# Altium schematic sheet STM32H7XX_100PIN.SchDoc
size A1
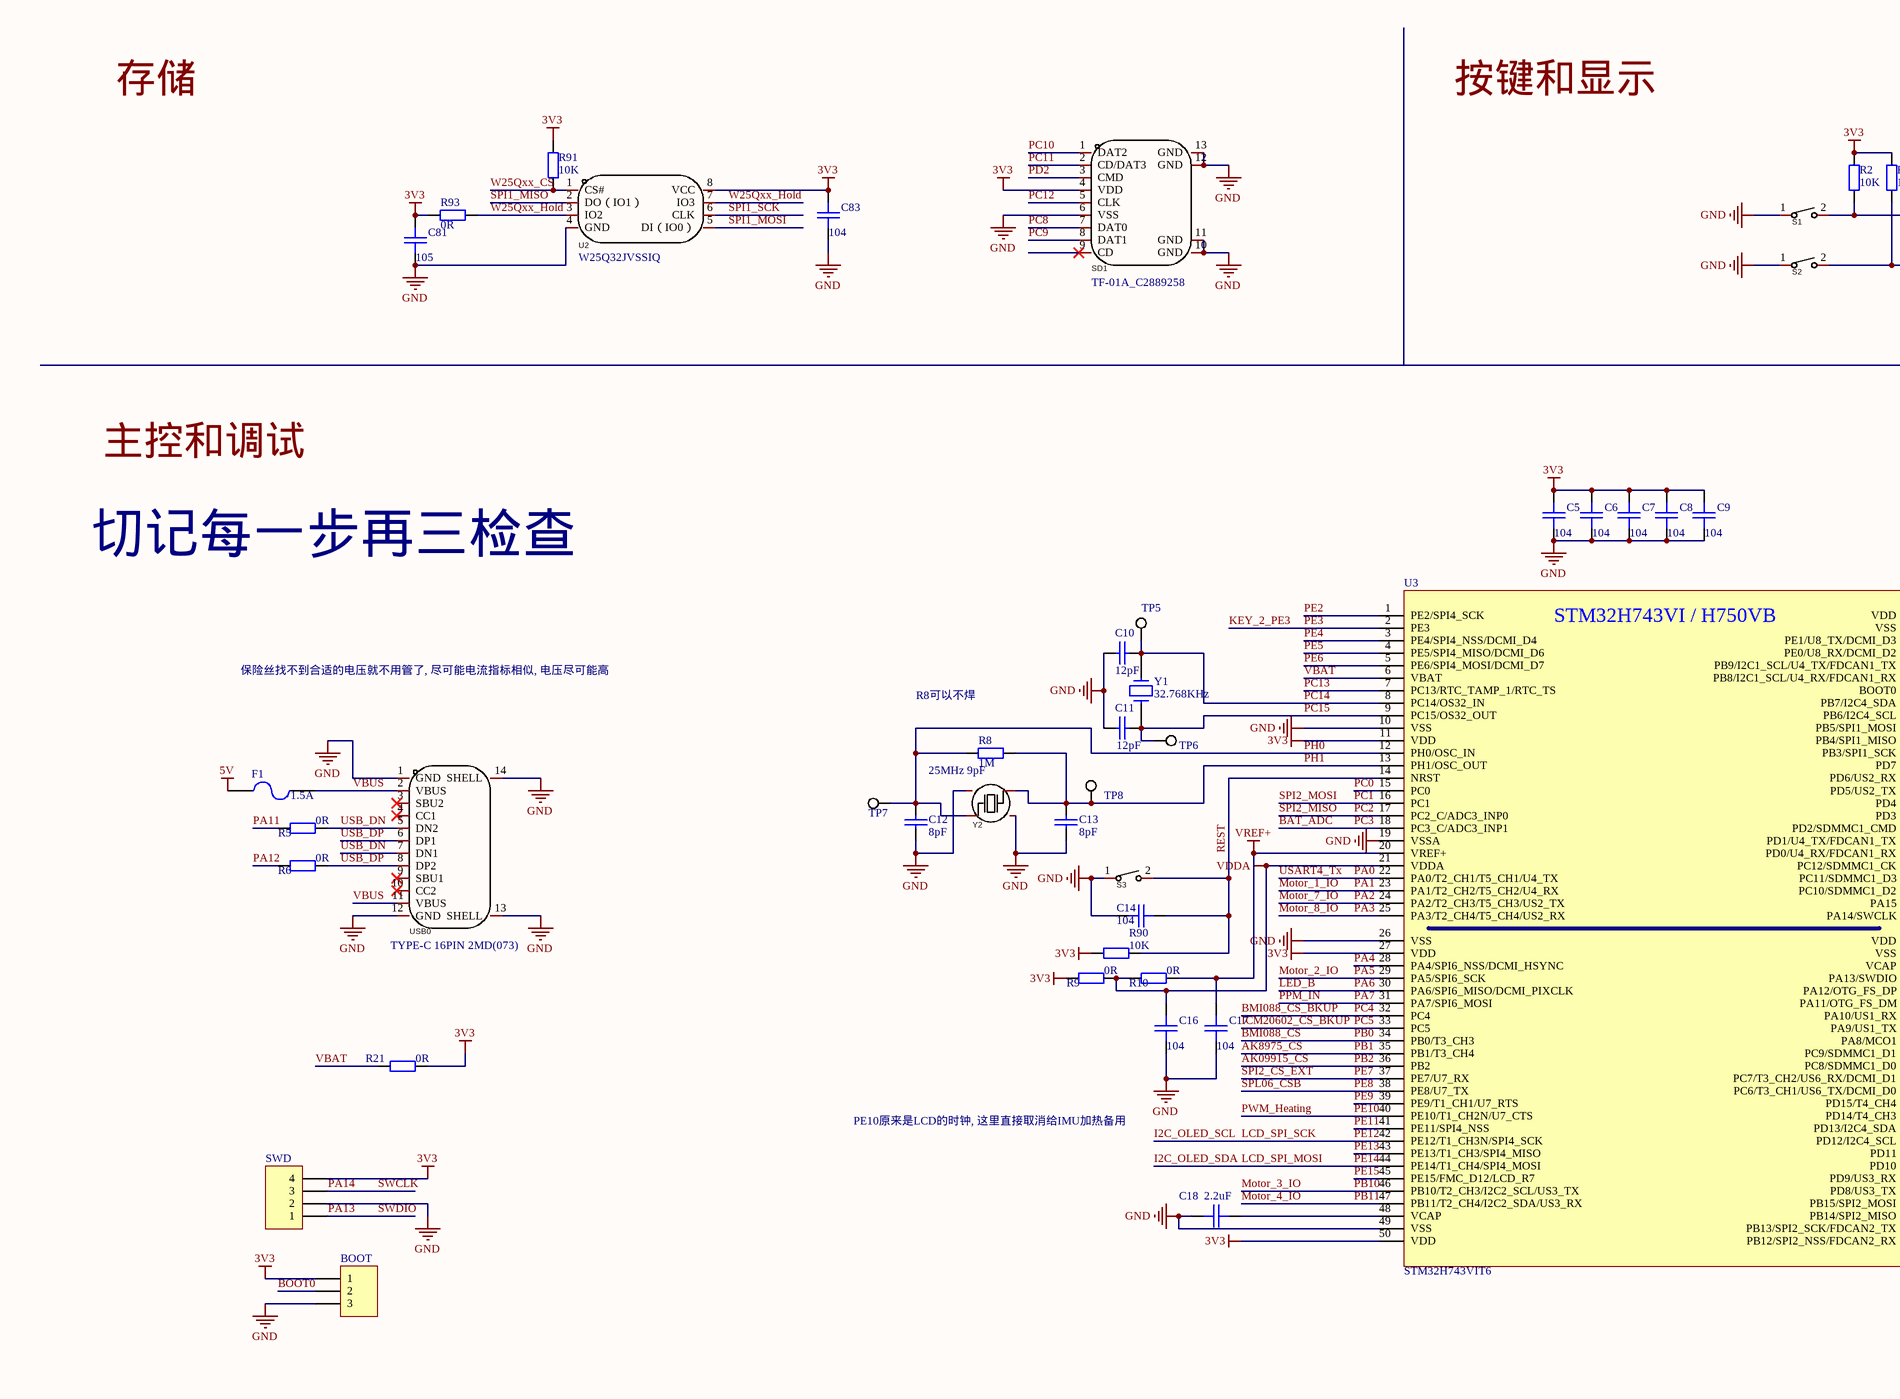
[diagram p0: STM32H7XX_100PIN.SchDoc, top left]
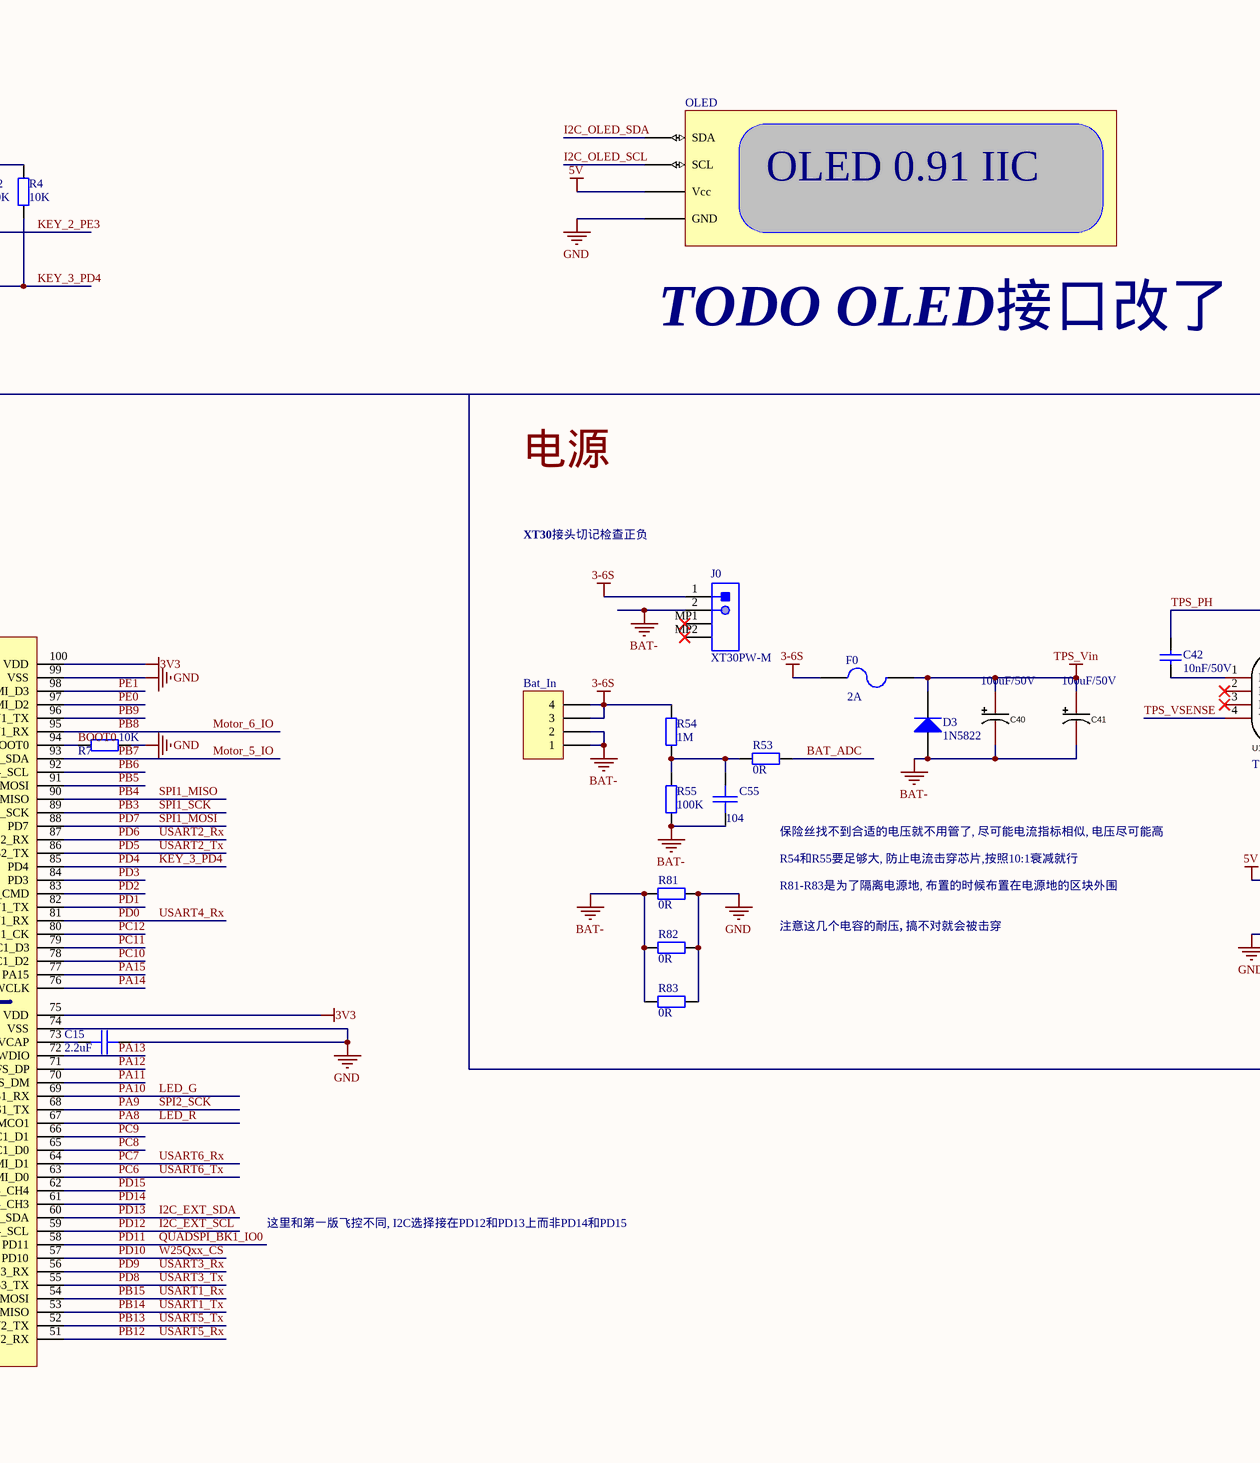
[diagram p1: STM32H7XX_100PIN.SchDoc, top middle]
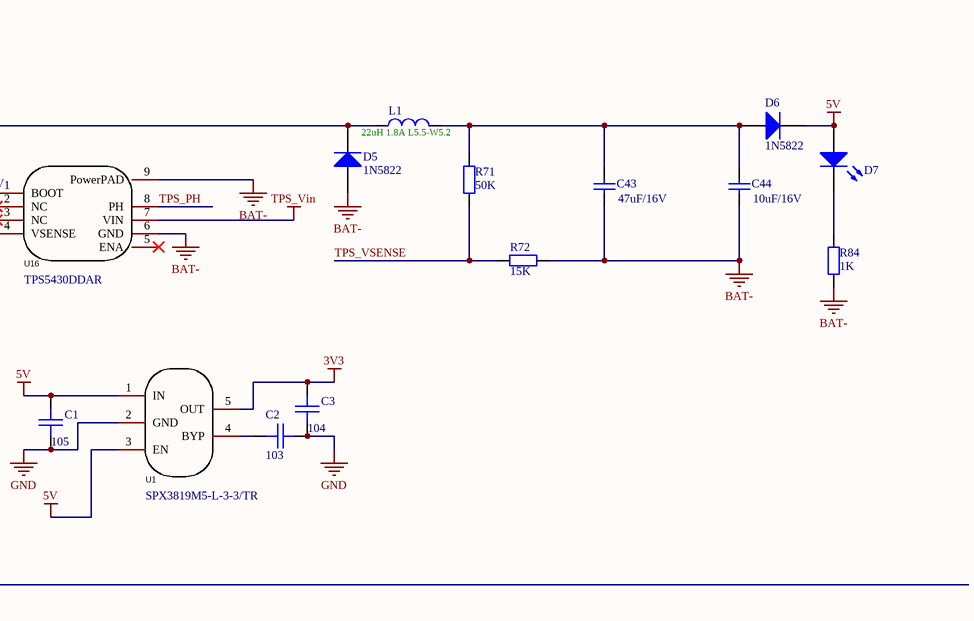
[diagram p2: STM32H7XX_100PIN.SchDoc, top right]
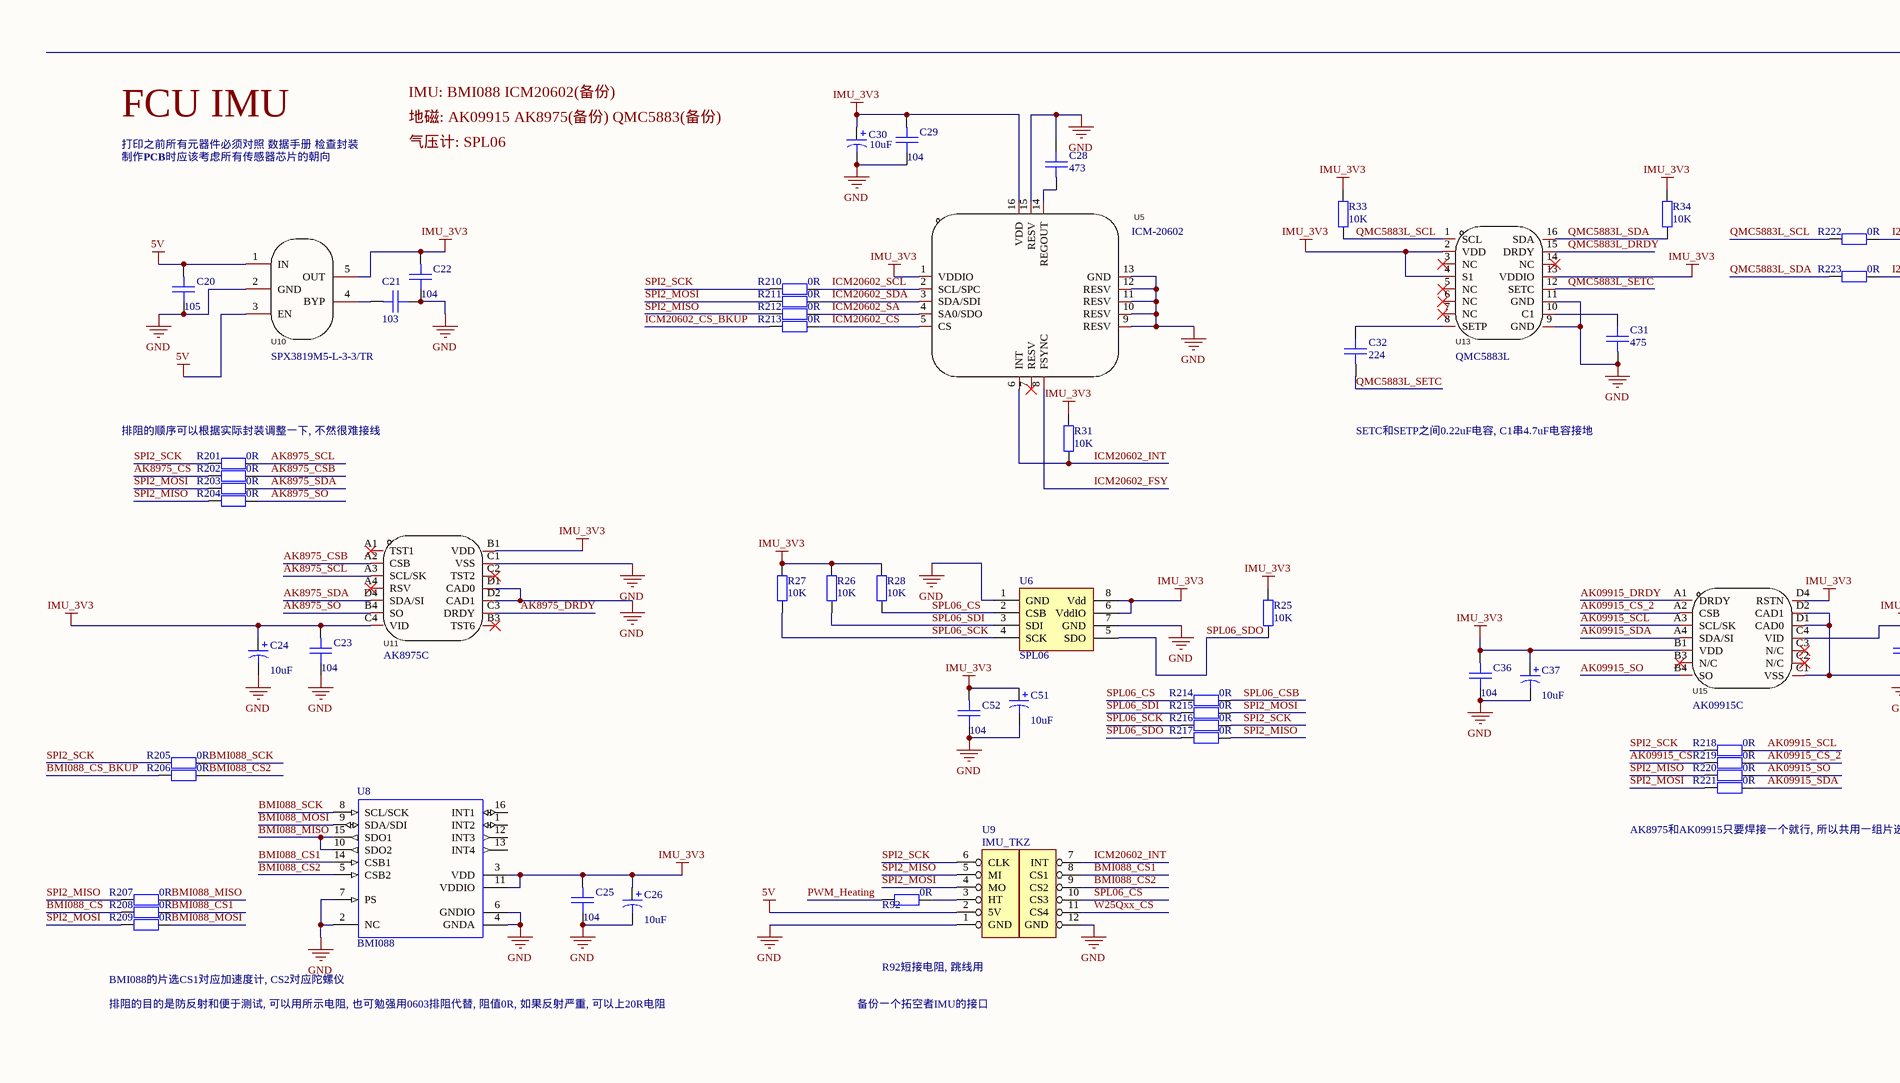
[diagram p3: STM32H7XX_100PIN.SchDoc, bottom left]
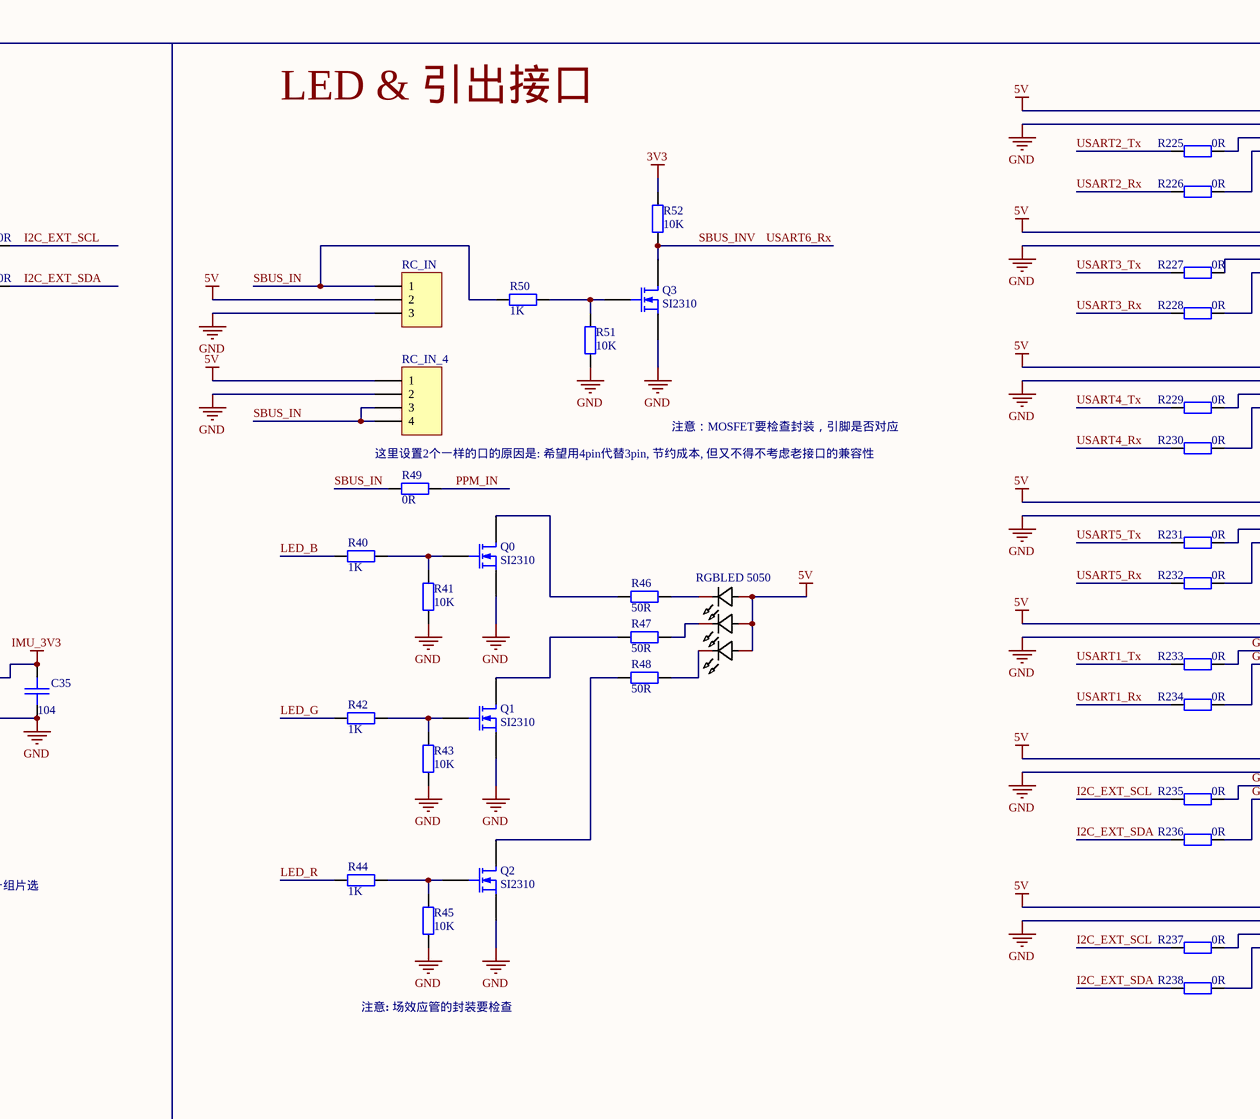
[diagram p4: STM32H7XX_100PIN.SchDoc, bottom middle]
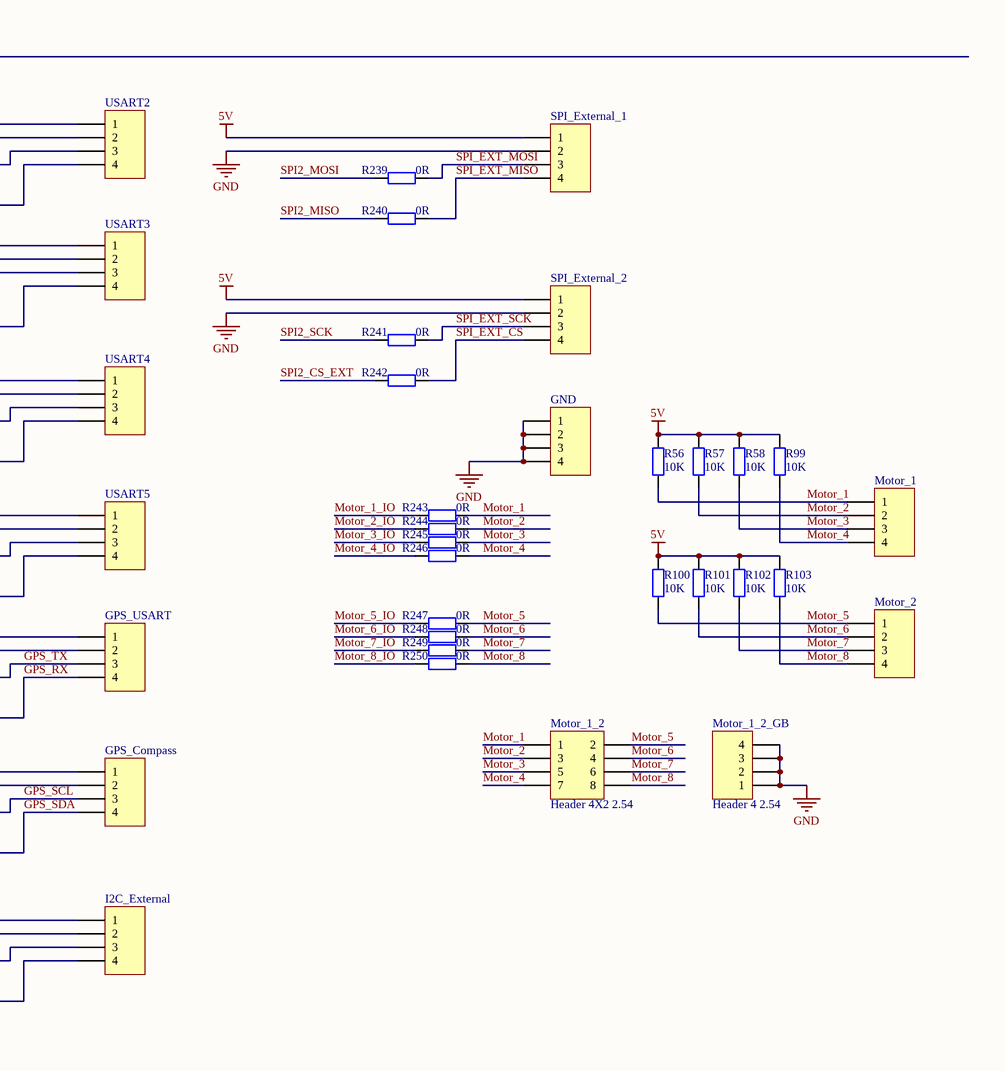
[diagram p5: STM32H7XX_100PIN.SchDoc, bottom right]

## Parts
Bat_In  SH1.0-4  [SH_1.0_卧]  (value not drawn)
BOOT  Header 3 2.54  [HDR1X3]  (value not drawn)
C1  105  [C0402]
C2  103  [C0402]
C3  104  [C0402]
C5  104  [C0402]
C6  104  [C0402]
C7  104  [C0402]
C8  104  [C0402]
C9  104  [C0402]
C10  12pF  [C0402]
C11  12pF  [C0402]
C12  8pF  [C0402]
C13  8pF  [C0402]
C14  104  [C0402]
C15  2.2uF  [C0402]
C16  104  [C0402]
C17  104  [C0402]
C18  2.2uF  [C0402]
C20  105  [C0402]
C21  103  [C0402]
C22  104  [C0402]
C23  104  [C0402]
C24  10uF  [TAN-A(3216-18)]
C25  104  [C0402]
C26  10uF  [TAN-A(3216-18)]
C28  473  [C0402]
C29  104  [C0402]
C30  10uF  [TAN-A(3216-18)]
C31  475  [C0402]
C32  224  [C0402]
C35  104  [C0402]
C36  104  [C0402]
C37  10uF  [TAN-A(3216-18)]
C40  100uF/50V  [CAP-SMD_BD6.3-L6.6-W6.6-FD]
C41  100uF/50V  [CAP-SMD_BD6.3-L6.6-W6.6-FD]
C42  10nF/50V  [C1206]
C43  47uF/16V  [C1210]
C44  10uF/16V  [C1210]
C51  10uF  [TAN-A(3216-18)]
C52  104  [C0402]
C55  104  [C0402]
C81  105  [C0402]
C83  104  [C0402]
D0  RGBLED 5050  [LED-SMD_6P-L5.0-W5.0-TL_TC5050RGBF08]
D3  1N5822  [SMA_L4.3-W2.5-LS5.0-RD]
D5  1N5822  [SMA_L4.3-W2.5-LS5.0-RD]
D6  1N5822  [SMA_L4.3-W2.5-LS5.0-RD]
D7  Red LED  [LED0603]  (value not drawn)
F0  2A  [FU 1210]
F1  1.5A  [FU 0402]
GND  SH1.0-4  [SH_1.0_卧]  (value not drawn)
GPS_Compass  SH1.0-4  [SH_1.0_卧]  (value not drawn)
GPS_USART  SH1.0-4  [SH_1.0_卧]  (value not drawn)
I2C_External  SH1.0-4  [SH_1.0_卧]  (value not drawn)
J0  XT30PW-M  [AMASS-XT30PW-M]
L1  22uH 1.8A L5.5-W5.2  [IND-SMD_L5.5-W5.2]
Motor_1  SH1.0-4  [SH_1.0_卧]  (value not drawn)
Motor_1_2  Header 4X2 2.54  [HDR2X4]
Motor_1_2_GB  Header 4 2.54  [HDR1X4]
Motor_2  SH1.0-4  [SH_1.0_卧]  (value not drawn)
OLED  OLED 0.91  [PCBComponent_1]  (value not drawn)
Q0  SI2310  [SOT-23R]
Q1  SI2310  [SOT-23R]
Q2  SI2310  [SOT-23R]
Q3  SI2310  [SOT-23R]
R2  10K  [R0402]
R4  10K  [R0402]
R5  0R  [R0402]
R6  0R  [R0402]
R7  10K  [R0402]
R8  1M  [R0402]
R9  0R  [R0402]
R10  0R  [R0402]
R21  0R  [R0402]
R25  10K  [R0402]
R26  10K  [R0402]
R27  10K  [R0402]
R28  10K  [R0402]
R31  10K  [R0402]
R33  10K  [R0402]
R34  10K  [R0402]
R40  1K  [R0402]
R41  10K  [R0402]
R42  1K  [R0402]
R43  10K  [R0402]
R44  1K  [R0402]
R45  10K  [R0402]
R46  50R  [R0402]
R47  50R  [R0402]
R48  50R  [R0402]
R49  0R  [R0402]
R50  1K  [R0402]
R51  10K  [R0402]
R52  10K  [R0402]
R53  0R  [R0402]
R54  1M  [R0402]
R55  100K  [R0402]
R56  10K  [R0402]
R57  10K  [R0402]
R58  10K  [R0402]
R71  50K  [0805]
R72  15K  [0805]
R81  0R  [R0402]
R82  0R  [R0402]
R83  0R  [R0402]
R84  1K  [R0402]
R90  10K  [R0402]
R91  10K  [R0402]
R92  0R  [R0402]
R93  value 0R  [R0402]  (hidden comment: 10K)
R99  10K  [R0402]
R100  10K  [R0402]
R101  10K  [R0402]
R102  10K  [R0402]
R103  10K  [R0402]
R201  0R  [R0402]
R202  0R  [R0402]
R203  0R  [R0402]
R204  0R  [R0402]
R205  0R  [R0402]
R206  0R  [R0402]
R207  0R  [R0402]
R208  0R  [R0402]
R209  0R  [R0402]
R210  0R  [R0402]
R211  0R  [R0402]
R212  0R  [R0402]
R213  0R  [R0402]
R214  0R  [R0402]
R215  0R  [R0402]
R216  0R  [R0402]
R217  0R  [R0402]
R218  0R  [R0402]
R219  0R  [R0402]
R220  0R  [R0402]
R221  0R  [R0402]
R222  0R  [R0402]
R223  0R  [R0402]
R225  0R  [R0402]
R226  0R  [R0402]
R227  0R  [R0402]
R228  0R  [R0402]
R229  0R  [R0402]
R230  0R  [R0402]
R231  0R  [R0402]
R232  0R  [R0402]
R233  0R  [R0402]
R234  0R  [R0402]
R235  0R  [R0402]
R236  0R  [R0402]
R237  0R  [R0402]
R238  0R  [R0402]
R239  0R  [R0402]
R240  0R  [R0402]
R241  0R  [R0402]
R242  0R  [R0402]
R243  0R  [R0402]
R244  0R  [R0402]
R245  0R  [R0402]
R246  0R  [R0402]
R247  0R  [R0402]
R248  0R  [R0402]
R249  0R  [R0402]
R250  0R  [R0402]
RC_IN  SH 1.0-3  [SH_1.0_3P卧]  (value not drawn)
RC_IN_4  SH1.0-4  [SH_1.0_卧]  (value not drawn)
S1  TS-1092S-B3D2-G  [SW-SMD_L6.1-W3.6-LS7.9]  (value not drawn)
S2  TS-1092S-B3D2-G  [SW-SMD_L6.1-W3.6-LS7.9]  (value not drawn)
S3  TS-1092S-B3D2-G  [SW-SMD_L6.1-W3.6-LS7.9]  (value not drawn)
SD1  TF-01A_C2889258  [TF-SMD_TF-02]
SPI_External_1  SH1.0-4  [SH_1.0_卧]  (value not drawn)
SPI_External_2  SH1.0-4  [SH_1.0_卧]  (value not drawn)
SWD  SH1.0-4  [SH_1.0_卧]  (value not drawn)
TP5  Test Point  [TP-SM-C-100]  (value not drawn)
TP6  Test Point  [TP-SM-C-100]  (value not drawn)
TP7  Test Point  [TP-SM-C-100]  (value not drawn)
TP8  Test Point  [TP-SM-C-100]  (value not drawn)
U1  SPX3819M5-L-3-3/TR  [SOT-23-5_L3.0-W1.7-P0.95-LS2.8-BL]
U2  W25Q32JVSSIQ  [SOIC-8_L5.3-W5.3-P1.27-LS8.0-BL]
U3  STM32H743VIT6  [LQFP100-14*14]
U5  ICM-20602  [LGA-16_L3.0-W3.0-P0.50-BL]
U6  SPL06  [LGA-2_5X2MM]
U8  BMI088  [BOSC-LGA-16-BMI088_V]
U9  IMU_TKZ  [IMU_TKZ_SM2]
U10  SPX3819M5-L-3-3/TR  [SOT-23-5_L3.0-W1.7-P0.95-LS2.8-BL]
U11  AK8975C  [BGA-14_L2.0-W2.0-P0.50-BR_AK8975]
U13  QMC5883L  [LGA-16_L3.0-W3.0-P0.50-BL_SQ]
U15  AK09915C  [BGA-14_L1.6-W1.6-BR-AK09915C]
U16  TPS5430DDAR  [ESOP-8_L4.9-W3.9-P1.27-LS6.0-TL-EP]
USART2  SH1.0-4  [SH_1.0_卧]  (value not drawn)
USART3  SH1.0-4  [SH_1.0_卧]  (value not drawn)
USART4  SH1.0-4  [SH_1.0_卧]  (value not drawn)
USART5  SH1.0-4  [SH_1.0_卧]  (value not drawn)
USB0  TYPE-C 16PIN 2MD(073)  [USB-C-SMD_TYPE-C-6PIN-2MD-073]
Y1  32.768KHz  [OSC 3215-2P]
Y2  25MHz 9pF  [OSC-SMD_4P-L3.2-W2.5-BL]

## Nets
3-6S: Bat_In.3 Bat_In.4 F0.1 J0.1 R54.1
3V3: BOOT.1 C3.1 C5.1 C6.1 C7.1 C8.1 C9.1 C81.1 C83.1 R2.2 R4.2 R9.1 R21.2 R52.1 R90.1 R91.2 R93.2 SD1.4(VDD) SWD.4 U1.5(OUT) U2.8(VCC) U3.11(VDD) U3.27(VDD) U3.50(VDD) U3.75(VDD) U3.100(VDD)
5V: C1.1 C20.1 D0.1(+) D0.2(+) D0.3(+) D6.2(K) D7.1(A) F1.1 GPS_Compass.1 GPS_USART.1 I2C_External.1 OLED.1(Vcc) R56.1 R57.1 R58.1 R99.1 R100.1 R101.1 R102.1 R103.1 RC_IN.2 RC_IN_4.1 SPI_External_1.1 SPI_External_2.1 U1.1(IN) U1.3(EN) U9.2(5V) U10.1(IN) U10.3(EN) USART2.1 USART3.1 USART4.1 USART5.1
BAT-: Bat_In.1 Bat_In.2 C40.2 C41.2 C43.1 C44.1 C55.2 D3.1(A) D5.1(A) J0.2 R55.2 R72.2 R81.2 R82.2 R83.2 R84.2 U16.6(GND) U16.9(PowerPAD)
GND: BOOT.3 C1.2 C2.2 C3.2 C5.2 C6.2 C7.2 C8.2 C9.2 C10.1 C11.1 C12.2 C13.1 C14.1 C15.1 C16.2 C17.2 C18.2 C20.2 C21.2 C22.2 C23.2 C24.2 C25.2 C26.2 C28.2 C29.2 C30.2 C31.1 C35.2 C36.2 C37.2 C51.2 C52.2 C81.2 C83.2 GND.1 GND.2 GND.3 GND.4 GPS_Compass.2 GPS_USART.2 I2C_External.2 Motor_1_2_GB.1 Motor_1_2_GB.2 Motor_1_2_GB.3 Motor_1_2_GB.4 OLED.0(GND) Q0.3(S) Q1.3(S) Q2.3(S) Q3.3(S) R7.2 R41.2 R43.2 R45.2 R51.2 R81.1 R82.1 R83.1 RC_IN.3 RC_IN_4.2 S1.1 S2.1 S3.1 SD1.6(VSS) SD1.10(GND) SD1.11(GND) SD1.12(GND) SD1.13(GND) SPI_External_1.2 SPI_External_2.2 SWD.2 U1.2(GND) U2.4(GND) U3.10(VSS) U3.19(VSSA) U3.26(VSS) U3.49(VSS) U3.74(VSS) U3.99(VSS) U5.9(RESV) U5.10(RESV) U5.11(RESV) U5.12(RESV) U5.13(GND) U5.15(RESV) U6.1(GND) U6.7(GND) U8.2(NC) U8.4(GNDA) U8.6(GNDIO) U8.7(PS) U9.1(GND) U9.12(GND) U10.2(GND) U11.C1(VSS) U11.D1(CAD0) U11.D2(CAD1) U13.9(GND) U13.11(GND) U15.C1(VSS) U15.D1(CAD0) U15.D2(CAD1) USART2.2 USART3.2 USART4.2 USART5.2 USB0.1(GND) USB0.12(GND) USB0.13(SHELL) USB0.14(SHELL) Y2.2 Y2.4
IMU_3V3: C22.1 C23.1 C24.1 C25.1 C26.1 C29.1 C30.1 C35.1 C36.1 C37.1 C51.1 C52.1 R25.2 R26.2 R27.2 R28.2 R31.2 R33.2 R34.2 U5.1(VDDIO) U5.16(VDD) U6.6(VddIO) U6.8(Vdd) U8.3(VDD) U8.11(VDDIO) U10.5(OUT) U11.B1(VDD) U11.C4(VID) U13.2(VDD) U13.4(S1) U13.13(VDDIO) U15.B1(VDD) U15.C4(VID) U15.D4(RSTN)
TPS_Vin: C40.1 C41.1 D3.2(K) F0.2 U16.7(VIN)
VDDA: C16.1 R9.2 R10.1 U3.21(VDDA)
VREF+: C17.1 R10.2 U3.20(VREF+)
AK8975_CS: R202.1 U3.35(PB1/T3_CH4)  [also labelled PB1]
AK8975_CSB: R202.2 U11.A2(CSB)
AK8975_DRDY: U11.C3(DRDY)
AK8975_SCL: R201.2 U11.A3(SCL/SK)
AK8975_SDA: R203.2 U11.D4(SDA/SI)
AK8975_SO: R204.2 U11.B4(SO)
AK09915_CS: R219.1 U3.36(PB2)  [also labelled PB2]
AK09915_CS_2: R219.2 U15.A2(CSB)
AK09915_DRDY: U15.A1(DRDY)
AK09915_SCL: R218.2 U15.A3(SCL/SK)
AK09915_SDA: R221.2 U15.A4(SDA/SI)
AK09915_SO: R220.2 U15.B4(SO)
BAT_ADC: R53.1 U3.18(PC3_C/ADC3_INP1)  [also labelled PC3]
BMI088_CS: R208.1 U3.34(PB0/T3_CH3)  [also labelled PB0]
BMI088_CS1: R208.2 U8.14(CSB1) U9.8(CS1)
BMI088_CS2: R206.2 U8.5(CSB2) U9.9(CS2)
BMI088_CS_BKUP: R206.1 U3.32(PC4)  [also labelled PC4]
BMI088_MISO: R207.2 U8.10(SDO2) U8.15(SDO1)
BMI088_MOSI: R209.2 U8.9(SDA/SDI)
BMI088_SCK: R205.2 U8.8(SCL/SCK)
BOOT0: BOOT.2 R7.1 U3.94(BOOT0)
GPS_RX: GPS_USART.4 R234.2
GPS_SCL: GPS_Compass.3 R235.2
GPS_SDA: GPS_Compass.4 R236.2
GPS_TX: GPS_USART.3 R233.2
I2C_EXT_SCL: R222.2 R235.1 R237.1 U3.59(PD12/I2C4_SCL)  [also labelled PD12]
I2C_EXT_SDA: R223.2 R236.1 R238.1 U3.60(PD13/I2C4_SDA)  [also labelled PD13]
I2C_OLED_SCL: OLED.2(SCL) U3.42(PE12/T1_CH3N/SPI4_SCK)  [also labelled LCD_SPI_SCK, PE12]
I2C_OLED_SDA: OLED.3(SDA) U3.44(PE14/T1_CH4/SPI4_MOSI)  [also labelled LCD_SPI_MOSI, PE14]
ICM20602_CS: R213.2 U5.5(CS)
ICM20602_CS_BKUP: R213.1 U3.33(PC5)  [also labelled PC5]
ICM20602_FSY: U5.8(FSYNC)
ICM20602_INT: R31.1 U5.6(INT) U9.7(INT)
ICM20602_SA: R212.2 U5.4(SA0/SDO)
ICM20602_SCL: R210.2 U5.2(SCL/SPC)
ICM20602_SDA: R211.2 U5.3(SDA/SDI)
KEY_2_PE3: R2.1 S1.2 U3.2(PE3)  [also labelled PE3]
KEY_3_PD4: R4.1 S2.2 U3.85(PD4)  [also labelled PD4]
LED_B: R40.2 U3.30(PA6/SPI6_MISO/DCMI_PIXCLK)  [also labelled PA6]
LED_G: R42.2 U3.69(PA10/US1_RX)  [also labelled PA10]
LED_R: R44.2 U3.67(PA8/MCO1)  [also labelled PA8]
Motor_1: Motor_1.1 Motor_1_2.1 R56.2 R243.2
Motor_1_IO: R243.1 U3.23(PA1/T2_CH2/T5_CH2/U4_RX)  [also labelled PA1]
Motor_2: Motor_1.2 Motor_1_2.3 R57.2 R244.2
Motor_2_IO: R244.1 U3.29(PA5/SPI6_SCK)  [also labelled PA5]
Motor_3: Motor_1.3 Motor_1_2.5 R58.2 R245.2
Motor_3_IO: R245.1 U3.46(PB10/T2_CH3/I2C2_SCL/US3_TX)  [also labelled PB10]
Motor_4: Motor_1.4 Motor_1_2.7 R99.2 R246.2
Motor_4_IO: R246.1 U3.47(PB11/T2_CH4/I2C2_SDA/US3_RX)  [also labelled PB11]
Motor_5: Motor_1_2.2 Motor_2.1 R100.2 R247.2
Motor_5_IO: R247.1 U3.93(PB7/I2C4_SDA)  [also labelled PB7]
Motor_6: Motor_1_2.4 Motor_2.2 R101.2 R248.2
Motor_6_IO: R248.1 U3.95(PB8/I2C1_SCL/U4_RX/FDCAN1_RX)  [also labelled PB8]
Motor_7: Motor_1_2.6 Motor_2.3 R102.2 R249.2
Motor_7_IO: R249.1 U3.24(PA2/T2_CH3/T5_CH3/US2_TX)  [also labelled PA2]
Motor_8: Motor_1_2.8 Motor_2.4 R103.2 R250.2
Motor_8_IO: R250.1 U3.25(PA3/T2_CH4/T5_CH4/US2_RX)  [also labelled PA3]
PA0: R229.1 U3.22(PA0/T2_CH1/T5_CH1/U4_TX)  [also labelled USART4_Tx]
PA4: U3.28(PA4/SPI6_NSS/DCMI_HSYNC)
PA7: R49.1 U3.31(PA7/SPI6_MOSI)  [also labelled PPM_IN]
PA9: R201.1 R205.1 R210.1 R216.2 R218.1 R241.1 U3.68(PA9/US1_TX) U9.6(CLK)  [also labelled SPI2_SCK]
PA11: R5.1 U3.70(PA11/OTG_FS_DM)
PA12: R6.1 U3.71(PA12/OTG_FS_DP)
PA13: SWD.1 U3.72(PA13/SWDIO)  [also labelled SWDIO]
PA14: SWD.3 U3.76(PA14/SWCLK)  [also labelled SWCLK]
PA15: U3.77(PA15)
PB3: U2.6(CLK) U3.89(PB3/SPI1_SCK)  [also labelled SPI1_SCK]
PB4: U2.2(DO（IO1）) U3.90(PB4/SPI1_MISO)  [also labelled SPI1_MISO]
PB5: U3.91(PB5/SPI1_MOSI)
PB6: U3.92(PB6/I2C4_SCL)
PB9: U3.96(PB9/I2C1_SCL/U4_TX/FDCAN1_TX)
PB12: R232.1 U3.51(PB12/SPI2_NSS/FDCAN2_RX)  [also labelled USART5_Rx]
PB13: R231.1 U3.52(PB13/SPI2_SCK/FDCAN2_TX)  [also labelled USART5_Tx]
PB14: R233.1 U3.53(PB14/SPI2_MISO)  [also labelled USART1_Tx]
PB15: R234.1 U3.54(PB15/SPI2_MOSI)  [also labelled USART1_Rx]
PC0: U3.15(PC0)
PC1: R203.1 R209.1 R211.1 R215.2 R221.1 R239.1 U3.16(PC1) U9.4(MO)  [also labelled SPI2_MOSI]
PC2: R204.1 R207.1 R212.1 R217.2 R220.1 R240.1 U3.17(PC2_C/ADC3_INP0) U9.5(MI)  [also labelled SPI2_MISO]
PC6: U3.63(PC6/T3_CH1/US6_TX/DCMI_D0)  [also labelled USART6_Tx]
PC7: Q3.1(D) R52.2 U3.64(PC7/T3_CH2/US6_RX/DCMI_D1)  [also labelled SBUS_INV, USART6_Rx]
PC8: SD1.7(DAT0) U3.65(PC8/SDMMC1_D0)
PC9: SD1.8(DAT1) U3.66(PC9/SDMMC1_D1)
PC10: SD1.1(DAT2) U3.78(PC10/SDMMC1_D2)
PC11: SD1.2(CD/DAT3) U3.79(PC11/SDMMC1_D3)
PC12: SD1.5(CLK) U3.80(PC12/SDMMC1_CK)
PC13: U3.7(PC13/RTC_TAMP_1/RTC_TS)
PC14: C10.2 TP5.1 U3.8(PC14/OS32_IN) Y1.2
PC15: C11.2 TP6.1 U3.9(PC15/OS32_OUT) Y1.1
PD0: R230.1 U3.81(PD0/U4_RX/FDCAN1_RX)  [also labelled USART4_Rx]
PD1: U3.82(PD1/U4_TX/FDCAN1_TX)
PD2: SD1.3(CMD) U3.83(PD2/SDMMC1_CMD)
PD3: U3.84(PD3)
PD5: R225.1 U3.86(PD5/US2_TX)  [also labelled USART2_Tx]
PD6: R226.1 U3.87(PD6/US2_RX)  [also labelled USART2_Rx]
PD7: U2.5(DI（IO0）) U3.88(PD7)  [also labelled SPI1_MOSI]
PD8: R227.1 U3.55(PD8/US3_TX)  [also labelled USART3_Tx]
PD9: R228.1 U3.56(PD9/US3_RX)  [also labelled USART3_Rx]
PD10: R91.1 U2.1(CS#) U3.57(PD10) U9.11(CS4)  [also labelled W25Qxx_CS]
PD11: U3.58(PD11)  [also labelled QUADSPI_BK1_IO0]
PD14: U3.61(PD14/T4_CH3)
PD15: U3.62(PD15/T4_CH4)
PE0: U3.97(PE0/U8_RX/DCMI_D2)
PE1: U3.98(PE1/U8_TX/DCMI_D3)
PE2: U3.1(PE2/SPI4_SCK)
PE4: U3.3(PE4/SPI4_NSS/DCMI_D4)
PE5: U3.4(PE5/SPI4_MISO/DCMI_D6)
PE6: U3.5(PE6/SPI4_MOSI/DCMI_D7)
PE7: R242.1 U3.37(PE7/U7_RX)  [also labelled SPI2_CS_EXT]
PE8: R214.2 U3.38(PE8/U7_TX)  [also labelled SPL06_CSB]
PE9: U3.39(PE9/T1_CH1/U7_RTS)
PE10: R92.1 U3.40(PE10/T1_CH2N/U7_CTS)  [also labelled PWM_Heating]
PE11: U3.41(PE11/SPI4_NSS)
PE13: U3.43(PE13/T1_CH3/SPI4_MISO)
PE15: U3.45(PE15/FMC_D12/LCD_R7)
PH0: C12.1 R8.1 TP7.1 U3.12(PH0/OSC_IN) Y2.1
PH1: C13.2 R8.2 TP8.1 U3.13(PH1/OSC_OUT) Y2.3
QMC5883L_DRDY: U13.15(DRDY)
QMC5883L_SCL: R33.1 R222.1 U13.1(SCL)
QMC5883L_SDA: R34.1 R223.1 U13.16(SDA)
QMC5883L_SETC: C32.1 U13.12(SETC)
REST: C14.2 R90.2 S3.2 U3.14(NRST)
SBUS_IN: R49.2 R50.2 RC_IN.1 RC_IN_4.3 RC_IN_4.4
SPI_EXT_CS: R242.2 SPI_External_2.4
SPI_EXT_MISO: R240.2 SPI_External_1.4
SPI_EXT_MOSI: R239.2 SPI_External_1.3
SPI_EXT_SCK: R241.2 SPI_External_2.3
SPL06_CS: R28.1 R214.1 U6.2(CSB) U9.10(CS3)
SPL06_SCK: R27.1 R216.1 U6.4(SCK)
SPL06_SDI: R26.1 R215.1 U6.3(SDI)
SPL06_SDO: R25.1 R217.1 U6.5(SDO)
TPS_PH: C42.1 D5.2(K) L1.1 U16.8(PH)
TPS_VSENSE: R71.2 R72.1 U16.4(VSENSE)
USB_DN: R5.2 USB0.5(DN2) USB0.7(DN1)
USB_DP: R6.2 USB0.6(DP1) USB0.8(DP2)
VBAT: R21.1 U3.6(VBAT)
VBUS: F1.2 USB0.2(VBUS) USB0.11(VBUS)
W25Qxx_Hold: R93.1 U2.3(IO2) U2.7(IO3)
NetC2_1: C2.1 U1.4(BYP)
NetC15_2: C15.2 U3.73(VCAP)
NetC18_1: C18.1 U3.48(VCAP)
NetC21_1: C21.1 U10.4(BYP)
NetC28_1: C28.1 U5.14(REGOUT)
NetC31_2: C31.2 U13.10(C1)
NetC32_2: C32.2 U13.8(SETP)
NetC42_2: C42.2 U16.1(BOOT)
NetC43_2: C43.2 C44.2 D6.1(A) L1.2 R71.1
NetC55_1: C55.1 R53.2 R54.2 R55.1
NetD0_4: D0.4(-) R46.1
NetD0_5: D0.5(-) R47.1
NetD0_6: D0.6(-) R48.1
NetD7_2: D7.2(K) R84.1
NetI2C_External_3: I2C_External.3 R237.2
NetI2C_External_4: I2C_External.4 R238.2
NetQ0_1: Q0.1(D) R46.2
NetQ0_2: Q0.2(G) R40.1 R41.1
NetQ1_1: Q1.1(D) R47.2
NetQ1_2: Q1.2(G) R42.1 R43.1
NetQ2_1: Q2.1(D) R48.2
NetQ2_2: Q2.2(G) R44.1 R45.1
NetQ3_2: Q3.2(G) R50.1 R51.1
NetR92_2: R92.2 U9.3(HT)
NetR225_2: R225.2 USART2.3
NetR226_2: R226.2 USART2.4
NetR227_2: R227.2 USART3.3
NetR228_2: R228.2 USART3.4
NetR229_2: R229.2 USART4.3
NetR230_2: R230.2 USART4.4
NetR231_2: R231.2 USART5.3
NetR232_2: R232.2 USART5.4

Not connected (* = marked no-connect by the designer): J0 MP1* MP2*; SD1 9(CD)*; U5 7(RESV)*; U8 1(INT2) 12(INT3) 13(INT4) 16(INT1); U11 A1(TST1)* A4(RSV)* B3(TST6)* C2(TST2)*; U13 3(NC)* 5(NC)* 6(NC)* 7(NC)* 14(NC)*; U15 B3(N/C)* C2(N/C)* C3(N/C)*; U16 2(NC)* 3(NC)* 5(ENA)*; USB0 3(SBU2)* 4(CC1)* 9(SBU1)* 10(CC2)*

## Notes on the sheet
- 存储
- 按键和显示
- TODO OLED接口改了
- 主控和调试
- 电源
- XT30接头切记检查正负
- 切记每一步再三检查
- 保险丝找不到合适的电压就不用管了, 尽可能电流指标相似, 电压尽可能高
- R8可以不焊
- R54和R55要足够大, 防止电流击穿芯片,按照10:1衰减就行
- 注意这几个电容的耐压, 搞不对就会被击穿
- R81-R83是为了隔离电源地, 布置的时候布置在电源地的区块外围
- PE10原来是LCD的时钟, 这里直接取消给IMU加热备用
- 这里和第一版飞控不同, I2C选择接在PD12和PD13上而非PD14和PD15
- IMU: BMI088 ICM20602(备份)
- LED & 引出接口
- 打印之前所有元器件必须对照 数据手册 检查封装
- FCU IMU
- 制作PCB时应该考虑所有传感器芯片的朝向
- 地磁: AK09915 AK8975(备份) QMC5883(备份)
- 气压计: SPL06
- 注意：MOSFET要检查封装，引脚是否对应
- 排阻的顺序可以根据实际封装调整一下, 不然很难接线
- SETC和SETP之间0.22uF电容, C1串4.7uF电容接地
- 这里设置2个一样的口的原因是: 希望用4pin代替3pin, 节约成本, 但又不得不考虑老接口的兼容性
- AK8975和AK09915只要焊接一个就行, 所以共用一组片选
- BMI088的片选CS1对应加速度计, CS2对应陀螺仪
- R92短接电阻, 跳线用
- 注意: 场效应管的封装要检查
- 排阻的目的是防反射和便于测试, 可以用所示电阻, 也可勉强用0603排阻代替, 阻值0R, 如果反射严重, 可以上20R电阻
- 备份一个拓空者IMU的接口
- (in symbol OLED 0.91) OLED 0.91 IIC
- (in symbol STM32H7XX_100PIN) STM32H743VI / H750VB

## Library data of the parts
Bat_In GND GPS_Compass GPS_USART I2C_External Motor_1 Motor_2 RC_IN_4 SPI_External_1 SPI_External_2 SWD USART2-USART5 = Header 4: Header, 4-Pin; LatestRevisionDate: 17-Jul-2002; LatestRevisionNote: Re-released for DXP Platform.; Publisher: Altium Limited
BOOT = Header 3: Header, 3-Pin; LatestRevisionDate: 17-Jul-2002; LatestRevisionNote: Re-released for DXP Platform.; Publisher: Altium Limited
C1-C3 C5-C9 C14-C18 C20-C23 C25 C28 C29 C31 C32 C35 C36 C52 C55 C81 C83 = CAP
C10-C13 = CAP: Capcitor
C24 C26 C30 C37 C51 = Cap Pol3: Polarized Capacitor (Surface Mount); Published: 8-Jun-2000; LatestRevisionDate: 29-May-2009; LatestRevisionNote: IPC-7351 Footprint Added.; PackageReference: C0805; Publisher: Altium Limited; PackageDescription: Chip Capacitor; Value: 10uF
C40 C41 = EEEFTH101XAP: Manufacturer: PANASONIC(����); Value: 100uF; Add into BOM: yes; Tolerance: ��20%; Rated Voltage: 50V; Ripple Current: 350mA@100kHz; Equivalent Series Resistance(ESR): 340m��@100kHz; φD: 6.3mm; L: 8mm; Lifetime @ Temp: 2000hrs@105��; Symbol: EEEFTH101XAP; Device: EEEFTH101XAP; Supplier: LCSC; Supplier Part: C165974; Manufacturer Part: EEEFTH101XAP; JLCPCB Part Class: Extended Part; LCSC Part Name: 100uF ��20% 50V; Supplier Footprint: SMD,D6.3xL7.7mm; Datasheet: https://atta.szlcsc.com/upload/public/pdf/source/20180830/C242129_F847FF312EB4DF3F63D4DACA6BE8D7E1.pdf; Convert to PCB: yes; Operating Temperature: -55��~+105��
C42-C44 = CMP-1035-02588-1: Case-Metric: 1608; Rated Voltage: 25 V; Case-EIA: 0603; Tolerance: Â±10%; Max Thickness: 1 mm; Technology: SMT
  C42: Value: 10nF/50V
  C43: Value: 47uF/16V
  C44: Value: 10uF/16V
D0 = TC5050RGBF08-3CJH-AF53A: Manufacturer: TCWIN(���); Add into BOM: yes; Emitted Color: RGB��ɫ; Dominant Wavelength: 465nm~470nm��515nm~520nm��620nm~625nm; Forward Current: 20mA; Power Dissipation: 200mW; Symbol: TC5050RGBF08-3CJH-AF53A; Device: TC5050RGBF08-3CJH-AF53A; Supplier: LCSC; Supplier Part: C784540; Manufacturer Part: TC5050RGBF08-3CJH-AF53A; JLCPCB Part Class: Extended Part; LCSC Part Name: RGB��ɫ; Supplier Footprint: SMD5050; Datasheet: https://atta.szlcsc.com/upload/public/pdf/source/20230731/34B1F7048EB892D234C2083EEE9FB085.pdf; Convert to PCB: yes; Diode Configuration: -; Lens Color: -; Peak Wavelength: -; Color Temperature: -; Viewing Angle: -; Mounting Sytle: -; Operating Temperature: -40��~+85��
D3 D5 D6 = Diode: SS34 Diode; pin to pad: 1>2 2>1; Published: 8-August-2017; PackageReference: DO214AC; Publisher: mazhongwei
D7 = LED0: 发光二极管; Published: 8-Jun-2000; LatestRevisionDate: 08-Jul-2005; LatestRevisionNote: Mech Layer 1 removed.; PackageReference: LED-0; Publisher: Altium Limited
F0 = Fuse 2: 保险丝; Value: 2A / 35V; Published: 8-Jun-2000; LatestRevisionDate: 17-Jul-2002; LatestRevisionNote: Re-released for DXP Platform.; PackageReference: PIN-W2/E2.8; Publisher: Altium Limited
F1 = Fuse 2: 保险丝; Value: 1.5A / 10V; Published: 8-Jun-2000; LatestRevisionDate: 17-Jul-2002; LatestRevisionNote: Re-released for DXP Platform.; PackageReference: PIN-W2/E2.8; Publisher: Altium Limited
J0 = XT30PW-M: XT Series Lithium Battery Male Connector, 4-pin TH; Manufacturer: AMASS; Manufacturer URL: http://www.china-amass.com; Part Number: XT30PW-M; Publisher: Bolgen Studio
L1 = INDUCTOR_2: Value: CD54-22uH/1.8A
Motor_1_2 = Header 4X2: Header, 4-Pin, Dual row; LatestRevisionDate: 17-Jul-2002; LatestRevisionNote: Re-released for DXP Platform.; Publisher: Altium Limited
Motor_1_2_GB = Header 4H: Header, 4-Pin, Right Angle; LatestRevisionDate: 17-Jul-2002; LatestRevisionNote: Re-released for DXP Platform.; Publisher: Altium Limited
Q0-Q3 = MOSFET-N: N-Channel MOSFET; pin to pad: 1>3 3>1; Published: 8-Jun-2000; LatestRevisionDate: 17-Jul-2002; LatestRevisionNote: Re-released for DXP Platform.; PackageVersion: 1995/1996; PackageReference: E3; Publisher: Altium Limited; PackageDescription: TO, Flat Index; 3 In-Line, Axial Leads; Body Dia. 4.6mm; Lead Dia. 0.5 mm (max)
R2 R4-R10 R21 R25-R28 R31 R33 R34 R40-R58 R71 R72 R81-R84 R90-R93 R99-R103 R201-R223 R225-R250 = Res1: 贴片电阻; Published: 8-Jun-2000; LatestRevisionDate: 17-Jul-2002; LatestRevisionNote: Re-released for DXP Platform.; PackageReference: AXIAL-0.4; Publisher: Altium Limited
  R2 R4 R7 R25-R28 R31 R33 R34 R41 R43 R45 R51 R52 R56-R58 R90 R91 R99-R103: Value: 10K
  R5 R6 R9 R10 R21 R49 R53 R81-R83 R92 R201-R223 R225-R250: Value: 0R
  R8 R54: Value: 1M
  R40 R42 R44 R50 R84: Value: 1K
  R46-R48: Value: 50R
  R55: Value: 100K
  R71: Value: 50K
  R72: Value: 15K
RC_IN = Header 3: Header, 3-Pin; pin to pad: 1>3 3>1; LatestRevisionDate: 17-Jul-2002; LatestRevisionNote: Re-released for DXP Platform.; Publisher: Altium Limited
S1-S3 = TS-1092S-B3D2-G: Manufacturer: Yuandi(Ԫ��); Add into BOM: yes; Circuit: ��������; Actuator Style: ���ΰ�ť; Actuator/Cap Color: ��ɫ; Operating Force: 250gf@��30gf; Pin Style: Ÿ����; Switch Length: 6.1mm; Switch Width: 3.6mm; Switch Height: 2.5mm; Strike Gundam: ��; Symbol: TS-1092S-B3D2-G; Device: TS-1092S-B3D2-G; LCSC Part Name: 6.1*3.6*2.5mm ���� �ᴥ����; Supplier Part: C520860; Manufacturer Part: TS-1092S-B3D2-G; Supplier Footprint: SMD; JLCPCB Part Class: Extended Part; Datasheet: https://atta.szlcsc.com/upload/public/pdf/source/20200424/C520860_DA5AE47D9A9DC527FC720B5FF0895739.pdf; Supplier: LCSC; Convert to PCB: yes; Mounting Style: ����; Mechanical Life: -
SD1 = TF-01A_C2889258: Manufacturer: Yuandi(Ԫ��); Manufacturer Part: TF-01A; Add into BOM: yes; Card Connection Mode: �Ե�ʽ; Card Type: MicroSD��(TF��); Connector Type: ����; Maximum Body Height: 2mm; Symbol: TF-01A_C2889258; Device: TF-01A_C2889258; Supplier: LCSC; Supplier Part: C2889258; JLCPCB Part Class: Extended Part; LCSC Part Name: �Ե�ʽ MicroSD��(TF��) ����; Supplier Footprint: SMD; Datasheet: https://atta.szlcsc.com/upload/public/pdf/source/20210830/44259D2B93BF4B637A446EF1520C4989.pdf; Convert to PCB: yes; Operating Temperature Range: -
TP5-TP8 = TESTPOINT_WHITE
U1 U10 = SPX3819M5-L-3-3/TR: Manufacturer: MaxLinear(����); Add into BOM: yes; Output Type: �̶�; Maximum Input Voltage: 16V; Output Voltage: 3.3V; MAX Output Current: 500mA; Power Supply Rejection Ratio (PSRR): 70dB; Dropout Voltage: 700mV@(500mA); standby current: 8uA; Output Polarity: ����; Number of Outputs: 1; Symbol: SPX3819M5-L-3-3/TR; Device: SPX3819M5-L-3-3/TR; Supplier: LCSC; Manufacturer Part: SPX3819M5-L-3-3/TR; Supplier Part: C9055; JLCPCB Part Class: Extended Part; LCSC Part Name: ����16V ���3.3V 500mA; Supplier Footprint: SOT-23-5; Datasheet: https://atta.szlcsc.com/upload/public/pdf/source/20150720/1457707331934.pdf; Convert to PCB: yes; Operating Temperature: -40��~+125��
U2 = W25Q32JVSSIQ_C82344: Manufacturer: WINBOND(����); Add into BOM: yes; Symbol: W25Q32JVSSIQ; Device: W25Q32JVSSIQ_C82344; LCSC Part Name: W25Q32JVSSIQ; Supplier Part: C82344; Manufacturer Part: W25Q32JVSSIQ; Supplier Footprint: SOIC-8-208mil; JLCPCB Part Class: Extended Part; Datasheet: https://atta.szlcsc.com/upload/public/pdf/source/20160910/1473490310454.pdf; Supplier: LCSC; Convert to PCB: yes
U3 = STM32H7XX_100PIN
U5 = ICM-20602: Manufacturer: TDK InvenSense(Ӧ��ʢ); Add into BOM: yes; Symbol: ICM-20602; Device: ICM-20602; LCSC Part Name: ICM-20602; Supplier Part: C97633; Manufacturer Part: ICM-20602; Supplier Footprint: LGA-16; JLCPCB Part Class: Extended Part; Datasheet: https://atta.szlcsc.com/upload/public/pdf/source/20211201/22F52CD68708988CA74F73A6E0913E27.pdf; Supplier: LCSC; Convert to PCB: yes
U6 = FBM320: FBM320\BMP280\SPL06; Published: 8-August-2017; Publisher: mazhongwei; PackageReference: LGA-2_5X2MM
U8 = BOSC-BMI088-LGA-16: 6-axis Motion Tracking for High-performance Applications,; Manufacturer_Name: Bosch; Geometry.Height: 1.45mm; Manufacturer_Part_Number: BMI088; RS Part Number: *; RS Price/Stock: *; Arrow Part Number: BMI088; Arrow Price/Stock: https://www.arrow.com/en/products/bmi088/bosch; Datasheet Link: https://ae-bst.resource.bosch.com/media/_tech/media/datasheets/BST-BMI088-DS001-13.pdf
U11 = AK8975C: Manufacturer: AKM; Symbol: AK8975; Add into BOM: yes; Device: AK8975C; Supplier: LCSC; Manufacturer Part: AK8975C; Supplier Part: C32243; JLCPCB Part Class: Extended Part; LCSC Part Name: AK8975C; Supplier Footprint: BGA-14; Datasheet: https://atta.szlcsc.com/upload/public/pdf/source/20140614/1457707091296.pdf; Convert to PCB: yes
U13 = QMC5883L: Manufacturer: QST(�Ϻ����); Add into BOM: yes; Symbol: QMC5883L; Device: QMC5883L; LCSC Part Name: ����Ŵ�����; Supplier Part: C976032; Manufacturer Part: QMC5883L; Supplier Footprint: LGA-16(3x3x0.9); JLCPCB Part Class: Extended Part; Datasheet: https://atta.szlcsc.com/upload/public/pdf/source/20201217/C976032_5B9A2F3901E175046CBA037B1F18A1F2.pdf; Supplier: LCSC; Convert to PCB: yes
U15 = AK09915C: Manufacturer: AKM; Add into BOM: yes; supply voltage: 1.7V~3.6V; Symbol: AK09915C; Device: AK09915C; Supplier: LCSC; Supplier Part: C2654982; Manufacturer Part: AK09915C; JLCPCB Part Class: Extended Part; LCSC Part Name: 3����Դ�����; Supplier Footprint: WLCSP-14(1.6x1.6); Datasheet: https://atta.szlcsc.com/upload/public/pdf/source/20210704/DBB8DF14A7AE20C03CA2229D8BC1ED74.pdf; Convert to PCB: yes; Operating Temperature: -30��~+85��
U16 = TPS5430DDAR: Manufacturer: TI(��������); Add into BOM: yes; Function: ��ѹ��; Synchronous Rectification: ��; Output Type: �ɵ�; Number of Outputs: 1; Topology: ��ѹʽ; Input Voltage: 5.5V~36V; Output Voltage: 1.221V~32.04V; Output Current (Max): 3A; Switching Frequency: 500kHz; Symbol: TPS5430DDAR; Device: TPS5430DDAR; Supplier: LCSC; Manufacturer Part: TPS5430DDAR; Supplier Part: C9864; JLCPCB Part Class: Basic Part; LCSC Part Name: TPS5430DDAR; Supplier Footprint: SOP-8-EP; Datasheet: https://www.ti.com/cn/lit/gpn/tps5430; Convert to PCB: yes; Operating Temperature: -40��~+125��@(TJ)
USB0 = TYPE-C 16PIN 2MD(073): USB TYPE-C; Manufacturer: SHOU HAN(�׺�); Add into BOM: yes; Gender: ĸ; Number of Ports: 1; Number of Contacts: 16P; Current Rating - Power (Max): 5A; Symbol: TYPE-C 16PIN 2MD(073); Device: TYPE-C 16PIN 2MD(073); Supplier: LCSC; Supplier Part: C2765186; Manufacturer Part: TYPE-C 16PIN 2MD(073); JLCPCB Part Class: Extended Part; LCSC Part Name: Type-C ĸ ����; Supplier Footprint: SMD; Datasheet: https://atta.szlcsc.com/upload/public/pdf/source/20211123/39B17C16241EAC15C5E277BDA434118E.pdf; Convert to PCB: yes; Connector Type: Type-C; Standard: -; Mounting Style: ����; Operating Temperature Range: -25��~+85��
Y1 = CRYSTAL: Crystal 8MHz PLUG; Value: 8MHz
Y2 = TAXM8M4RDBCCT2T: Crystal 3225 25MHz; Manufacturer: YJX(�ž���); Value: 8MHz; Add into BOM: yes; Crystal Type: ��Ƭ��Դ����; Load Capacitance: 10pF; Equivalent Series Resistance (ESR): 250��; Frequency Tolerance: ��10ppm; Frequency Stability: ��15ppm; Symbol: TAXM8M4RDBCCT2T; Device: TAXM8M4RDBCCT2T; Supplier: LCSC; Supplier Part: C400090; Manufacturer Part: TAXM8M4RDBCCT2T; JLCPCB Part Class: Extended Part; LCSC Part Name: 8MHz ��10ppm 10pF; Supplier Footprint: SMD3225-4P; Datasheet: https://atta.szlcsc.com/upload/public/pdf/source/20190626/C400090_CF95B89E745AFE4EF2E392EF8AC009D6.pdf; Convert to PCB: yes; Operating Temperature: -40��~+85��